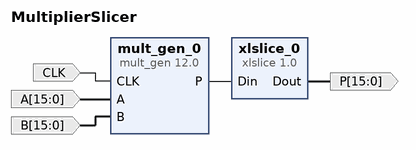
[diagram p0: block diagram of the top level]
# Vivado block design MultiplierSlicer, Vivado 2014.2
create_bd_design MultiplierSlicer

create_bd_port -dir I -type clk CLK
create_bd_port -dir I -from 15 -to 0 -type data A
create_bd_port -dir I -from 15 -to 0 -type data B
create_bd_port -dir O -from 15 -to 0 -type data P

create_bd_cell -type ip -vlnv xilinx.com:ip:mult_gen:12.0 mult_gen_0
set_property -dict [list \
  CONFIG.PortAType Signed \
  CONFIG.PortAWidth 16 \
  CONFIG.PortBType Signed \
  CONFIG.PortBWidth 16 \
] [get_bd_cells mult_gen_0]
create_bd_cell -type ip -vlnv xilinx.com:ip:xlslice:1.0 xlslice_0
set_property -dict {CONFIG.DIN_TO 7 CONFIG.DIN_FROM 22} [get_bd_cells xlslice_0]

# ---- connections ----

connect_bd_net [get_bd_ports CLK] [get_bd_pins mult_gen_0/CLK]
connect_bd_net [get_bd_ports A] [get_bd_pins mult_gen_0/A]
connect_bd_net [get_bd_ports B] [get_bd_pins mult_gen_0/B]
connect_bd_net [get_bd_pins mult_gen_0/P] [get_bd_pins xlslice_0/Din]
connect_bd_net [get_bd_pins xlslice_0/Dout] [get_bd_ports P]

validate_bd_design
save_bd_design
